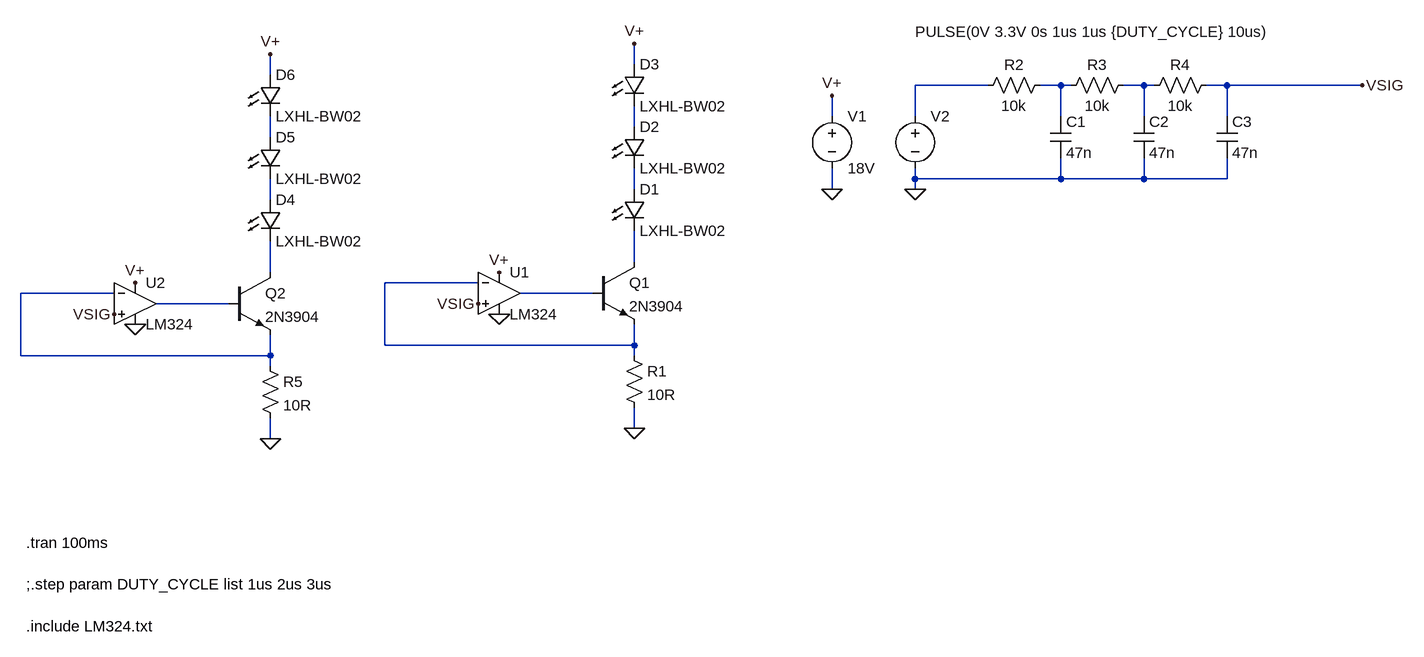
[diagram p0: schematic driver_option2.asc]
driver_option2.asc, the LTspice schematic file:
Version 4
SHEET 1 1628 680
WIRE 400 -320 400 -352
WIRE -160 -304 -160 -336
WIRE 944 -288 832 -288
WIRE 1056 -288 1024 -288
WIRE 1072 -288 1056 -288
WIRE 1184 -288 1152 -288
WIRE 1200 -288 1184 -288
WIRE 1312 -288 1280 -288
WIRE 1520 -288 1312 -288
WIRE 704 -240 704 -272
WIRE 832 -240 832 -288
WIRE 1056 -240 1056 -288
WIRE 1184 -240 1184 -288
WIRE 1312 -240 1312 -288
WIRE 400 -224 400 -256
WIRE -160 -208 -160 -240
WIRE 832 -144 832 -160
WIRE 1056 -144 1056 -176
WIRE 1056 -144 832 -144
WIRE 1184 -144 1184 -176
WIRE 1184 -144 1056 -144
WIRE 1312 -144 1312 -176
WIRE 1312 -144 1184 -144
WIRE 400 -128 400 -160
WIRE 704 -128 704 -160
WIRE 832 -128 832 -144
WIRE -160 -112 -160 -144
WIRE 400 -16 400 -64
WIRE -160 0 -160 -48
WIRE 160 16 16 16
WIRE -400 32 -544 32
WIRE 336 32 224 32
WIRE -224 48 -336 48
WIRE 16 112 16 16
WIRE 400 112 400 80
WIRE 400 112 16 112
WIRE -544 128 -544 32
WIRE -160 128 -160 96
WIRE -160 128 -544 128
WIRE 400 128 400 112
WIRE -160 144 -160 128
WIRE 400 240 400 208
WIRE -160 256 -160 224
FLAG 704 -128 0
FLAG 704 -272 V+
FLAG 192 0 V+
FLAG 192 64 0
FLAG 1520 -288 VSIG
FLAG 832 -128 0
FLAG 160 48 VSIG
FLAG 400 -352 V+
FLAG 400 240 0
FLAG -368 16 V+
FLAG -368 80 0
FLAG -400 64 VSIG
FLAG -160 -336 V+
FLAG -160 256 0
SYMBOL Opamps\\opamp2 192 -32 R0
SYMATTR InstName U1
SYMATTR Value LM324
SYMBOL voltage 704 -256 R0
WINDOW 123 0 0 Left 2
WINDOW 39 0 0 Left 2
SYMATTR InstName V1
SYMATTR Value 18V
SYMBOL npn 336 -16 R0
SYMATTR InstName Q1
SYMATTR Value 2N3904
SYMBOL voltage 832 -256 R0
WINDOW 3 0 -114 Left 2
WINDOW 123 0 0 Left 2
WINDOW 39 0 0 Left 2
SYMATTR Value PULSE(0V 3.3V 0s 1us 1us {DUTY_CYCLE} 10us)
SYMATTR InstName V2
SYMBOL LED 384 -128 R0
SYMATTR InstName D1
SYMATTR Value LXHL-BW02
SYMBOL res 384 112 R0
SYMATTR InstName R1
SYMATTR Value 10R
SYMBOL LED 384 -224 R0
SYMATTR InstName D2
SYMATTR Value LXHL-BW02
SYMBOL LED 384 -320 R0
SYMATTR InstName D3
SYMATTR Value LXHL-BW02
SYMBOL res 1040 -304 R90
WINDOW 0 0 56 VBottom 2
WINDOW 3 32 56 VTop 2
SYMATTR InstName R2
SYMATTR Value 10k
SYMBOL cap 1040 -240 R0
SYMATTR InstName C1
SYMATTR Value 47n
SYMBOL res 1168 -304 R90
WINDOW 0 0 56 VBottom 2
WINDOW 3 32 56 VTop 2
SYMATTR InstName R3
SYMATTR Value 10k
SYMBOL cap 1168 -240 R0
SYMATTR InstName C2
SYMATTR Value 47n
SYMBOL res 1296 -304 R90
WINDOW 0 0 56 VBottom 2
WINDOW 3 32 56 VTop 2
SYMATTR InstName R4
SYMATTR Value 10k
SYMBOL cap 1296 -240 R0
SYMATTR InstName C3
SYMATTR Value 47n
SYMBOL Opamps\\opamp2 -368 -16 R0
SYMATTR InstName U2
SYMATTR Value LM324
SYMBOL npn -224 0 R0
SYMATTR InstName Q2
SYMATTR Value 2N3904
SYMBOL LED -176 -112 R0
SYMATTR InstName D4
SYMATTR Value LXHL-BW02
SYMBOL res -176 128 R0
SYMATTR InstName R5
SYMATTR Value 10R
SYMBOL LED -176 -208 R0
SYMATTR InstName D5
SYMATTR Value LXHL-BW02
SYMBOL LED -176 -304 R0
SYMATTR InstName D6
SYMATTR Value LXHL-BW02
TEXT -536 544 Left 2 !.include LM324.txt
TEXT -536 416 Left 2 !.tran 100ms
TEXT -536 480 Left 2 !;.step param DUTY_CYCLE list 1us 2us 3us

The netlist it stands for:
* driver_option2.asc
XU1 VSIG N010 V+ 0 N012 LM324  ; pins In+ In- V+ V- OUT
V1 V+ 0 18V
Q1 N008 N012 N010 0 2N3904
V2 N001 0 PULSE(0V 3.3V 0s 1us 1us {DUTY_CYCLE} 10us)
D1 N006 N008 LXHL-BW02
R1 N010 0 10R
D2 N004 N006 LXHL-BW02
D3 V+ N004 LXHL-BW02
R2 N002 N001 10k
C1 N002 0 47n
R3 N003 N002 10k
C2 N003 0 47n
R4 VSIG N003 10k
C3 VSIG 0 47n
XU2 VSIG N011 V+ 0 N013 LM324  ; pins In+ In- V+ V- OUT
Q2 N009 N013 N011 0 2N3904
D4 N007 N009 LXHL-BW02
R5 N011 0 10R
D5 N005 N007 LXHL-BW02
D6 V+ N005 LXHL-BW02
.model D D
.lib standard.dio
.model NPN NPN
.model PNP PNP
.lib standard.bjt
.include LM324.txt
.tran 100ms
;.step param DUTY_CYCLE list 1us 2us 3us
.backanno
.end